# EAGLE schematic schematic (EAGLE 8.2.2)
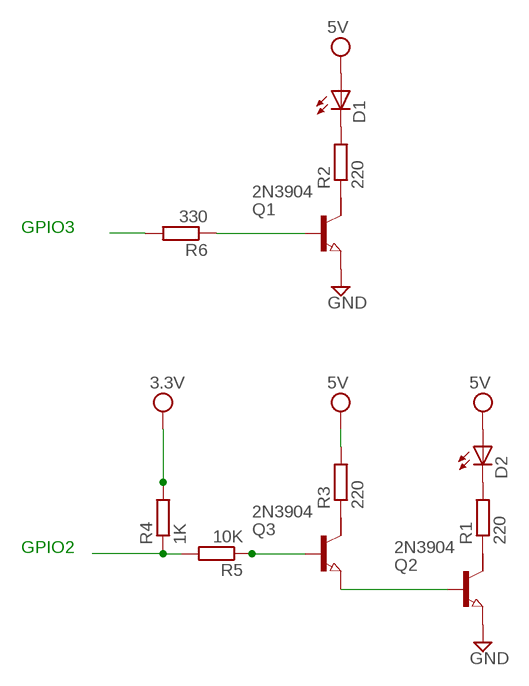
[diagram p0: schematic, sheet 1]

## Parts
D1  LED  [SMARTLED-TTW]
D2  LED  [SMARTLED-TTW]
Q1  2N3904  NPN-TRANSISTIOR-2COLSOT89  [SOT89]
Q2  2N3904  NPN-TRANSISTIOR-2COLSOT89  [SOT89]
Q3  2N3904  NPN-TRANSISTIOR-2COLSOT89  [SOT89]
R1  220  R  [R0805]
R2  220  R  [R0805]
R3  220  R  [R0805]
R4  1K  R  [R0805]
R5  10K  R  [R0805]
R6  330  R  [R0805]

## Nets
GND: Q1.3(E) Q2.3(E)
N$1: Q1.2(C) R2.1
N$2: D1.C@1(C) R2.2
N$3: R6.2
N$4: Q2.2(C) R1.1
N$5: D2.C@1(C) R1.2
N$6: Q3.2(C) R3.1
N$7: Q2.1(B) Q3.3(E)
N$8: Q1.1(B) R6.1
N$9: R4.1 R5.2
N$11: Q3.1(B) R5.1
VCC: D1.A@1(A) D2.A@1(A) R3.2 R4.2 ; supply symbol labelled 5V, 3.3V
Unconnected: Q1.2@1(C/) Q2.2@1(C/) Q3.2@1(C/)

## Notes on the sheet
- GPIO3
- GPIO2

## Library data of the parts
D1 D2 = led:LED: LED OSRAM: - CHIPLED LG R971, LG N971, LY N971, LG Q971, LY Q971, LO R971, LY R971 LH N974, LH R974 LS Q976, LO Q976, LY Q976 LO Q996 - Hyper CHIPLED LW Q18S LB Q993, LB Q99A, LB R99A - SideLED LS A670, LO A670, LY A670, LG A670, LP A670 LB A673, LV A673, LT A673, LW A673 LH A674 LY A675 LS A676, LA A676, LO A676, LY A676, LW A676 LS A679, LY A679, LG A679 - Hyper Micro SIDELED® LS Y876, LA Y876, LO Y876, LY Y876 LT Y87S - SmartLED LW L88C, LW L88S LB L89C, LB L89S, LG L890 LS L89K, LO L89K, LY L89K LS L896, LA L896, LO L896, LY L896 - TOPLED LS T670, LO T670, LY T670, LG T670, LP T670 LSG T670, LSP T670, LSY T670, LOP T670, LYG T670 LG T671, LOG T671, LSG T671 LB T673, LV T673, LT T673, LW T673 LH T674 LS T676, LA T676, LO T676, LY T676, LB T676, LH T676, LSB T676, LW T676 LB T67C, LV T67C, LT T67C, LS T67K, LO T67K, LY T67K, LW E67C LS E67B, LA E67B, LO E67B, LY E67B, LB E67C, LV E67C, LT E67C LW T67C LS T679, LY T679, LG T679 LS T770, LO T770, LY T770, LG T770, LP T770 LB T773, LV T773, LT T773, LW T773 LH T774 LS E675, LA E675, LY E675, LS T675 LS T776, LA T776, LO T776, LY T776, LB T776 LHGB T686 LT T68C, LB T68C - Hyper Mini TOPLED® LB M676 - Mini TOPLED Santana® LG M470 LS M47K, LO M47K, LY M47K Source: http://www.osram.convergy.de LUXEON: - LUMILED® LXK2-PW12-R00, LXK2-PW12-S00, LXK2-PW14-U00, LXK2-PW14-V00 LXK2-PM12-R00, LXK2-PM12-S00, LXK2-PM14-U00 LXK2-PE12-Q00, LXK2-PE12-R00, LXK2-PE12-S00, LXK2-PE14-T00, LXK2-PE14-U00 LXK2-PB12-K00, LXK2-PB12-L00, LXK2-PB12-M00, LXK2-PB14-N00, LXK2-PB14-P00, LXK2-PB14-Q00 LXK2-PR12-L00, LXK2-PR12-M00, LXK2-PR14-Q00, LXK2-PR14-R00 LXK2-PD12-Q00, LXK2-PD12-R00, LXK2-PD12-S00 LXK2-PH12-R00, LXK2-PH12-S00 LXK2-PL12-P00, LXK2-PL12-Q00, LXK2-PL12-R00 Source: www.luxeon.com KINGBRIGHT: KA-3528ASYC Source: www.kingbright.com
Q1-Q3 = semicon-smd-ipc:NPN-TRANSISTIOR-2COL: NPN TRANSISTOR 2 colletor pins
R1-R6 = eagle-ltspice:R: RESISTOR, European symbol; SPICEMODEL: NONE; SPICEPREFIX: R